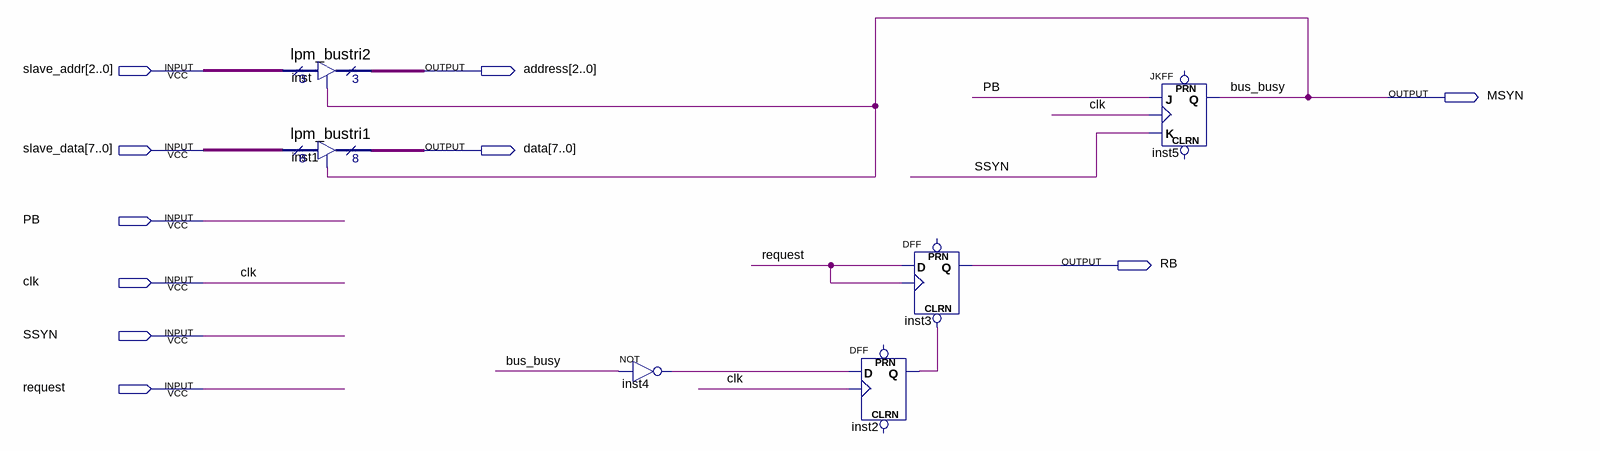
[diagram p0: schematic sheet]
// Quartus schematic master.bdf as structural Verilog: 6 symbols, 10 pins
module master (
  input  [2:0] slave_addr,
  input  [7:0] slave_data,
  input  PB,
  input  clk,
  input  SSYN,
  input  request,
  output [2:0] address,
  output MSYN,
  output [7:0] data,
  output RB
);

  wire inst2_q, inst4_out;

  lpm_bustri2 inst (.enabledt(MSYN), .data(slave_addr), .tridata(address));
  lpm_bustri1 inst1 (.enabledt(MSYN), .data(slave_data), .tridata(data));
  not inst4 (inst4_out, MSYN);
  DFF inst2 (.CLK(clk), .D(inst4_out), .Q(inst2_q));  // open: CLRN, PRN
  DFF inst3 (.CLRN(inst2_q), .CLK(request), .D(request), .Q(RB));  // open: PRN
  JKFF inst5 (.K(SSYN), .J(PB), .CLK(clk), .Q(MSYN));  // open: PRN, CLRN

  // Other names for the same wires on the sheet: bus_busy = MSYN
endmodule
